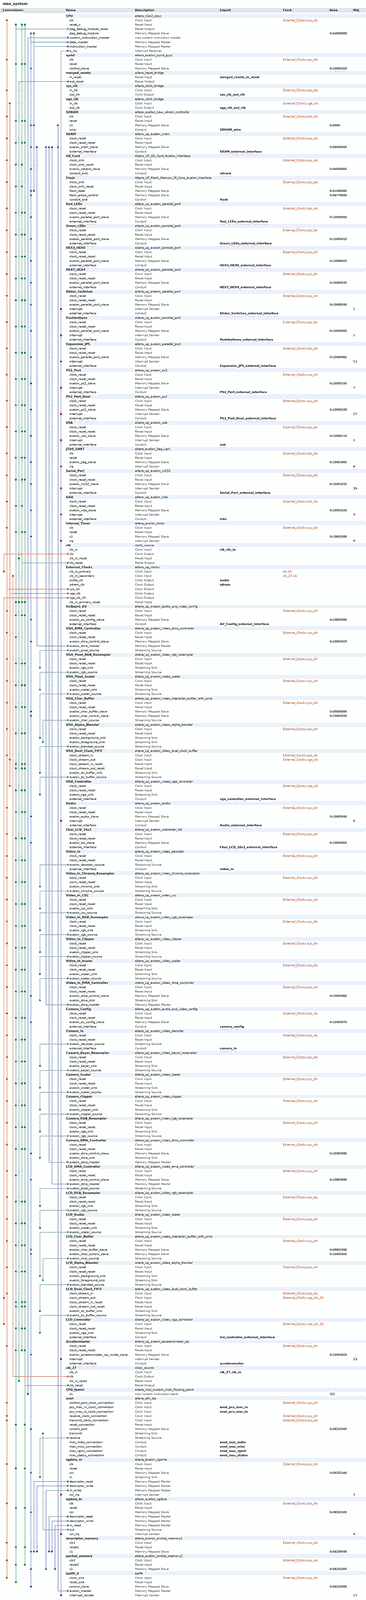
[diagram p0: system contents, whole]
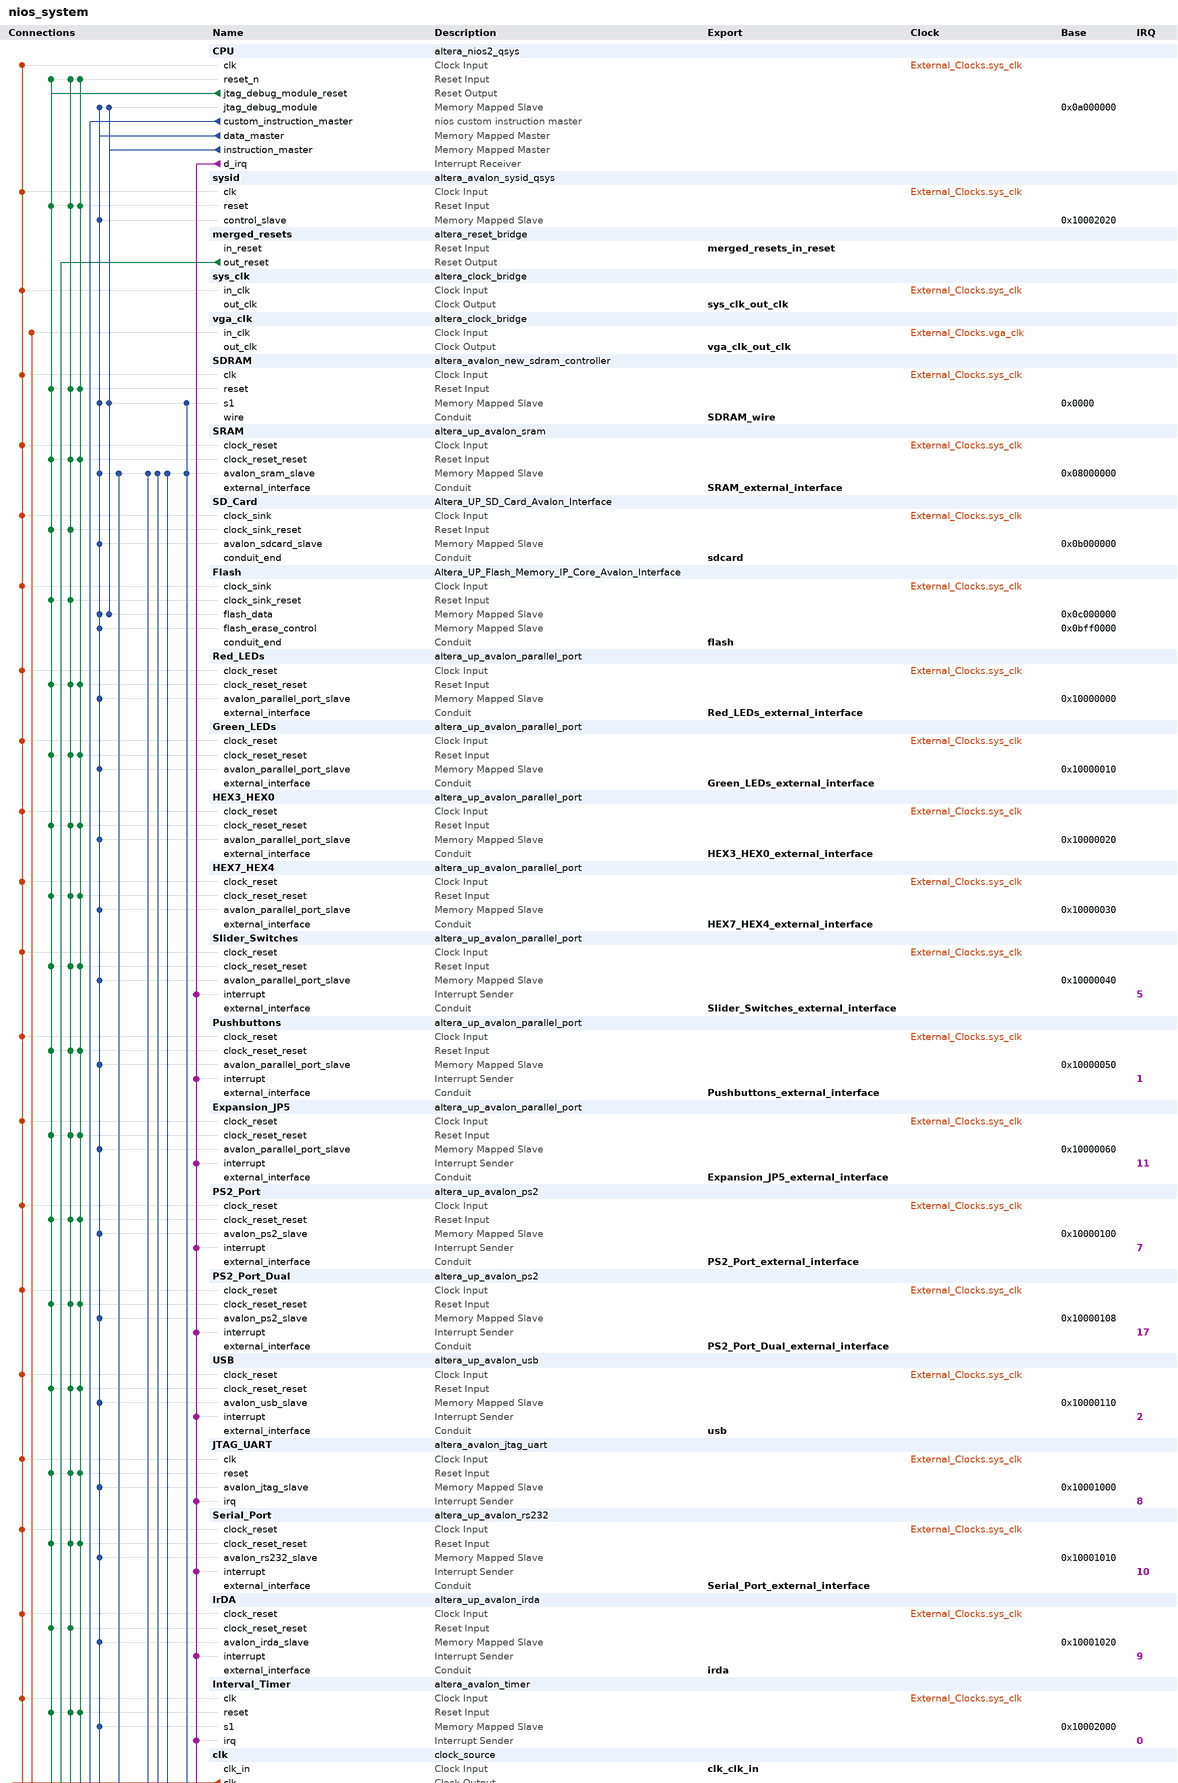
[diagram p1: system contents, upper part]
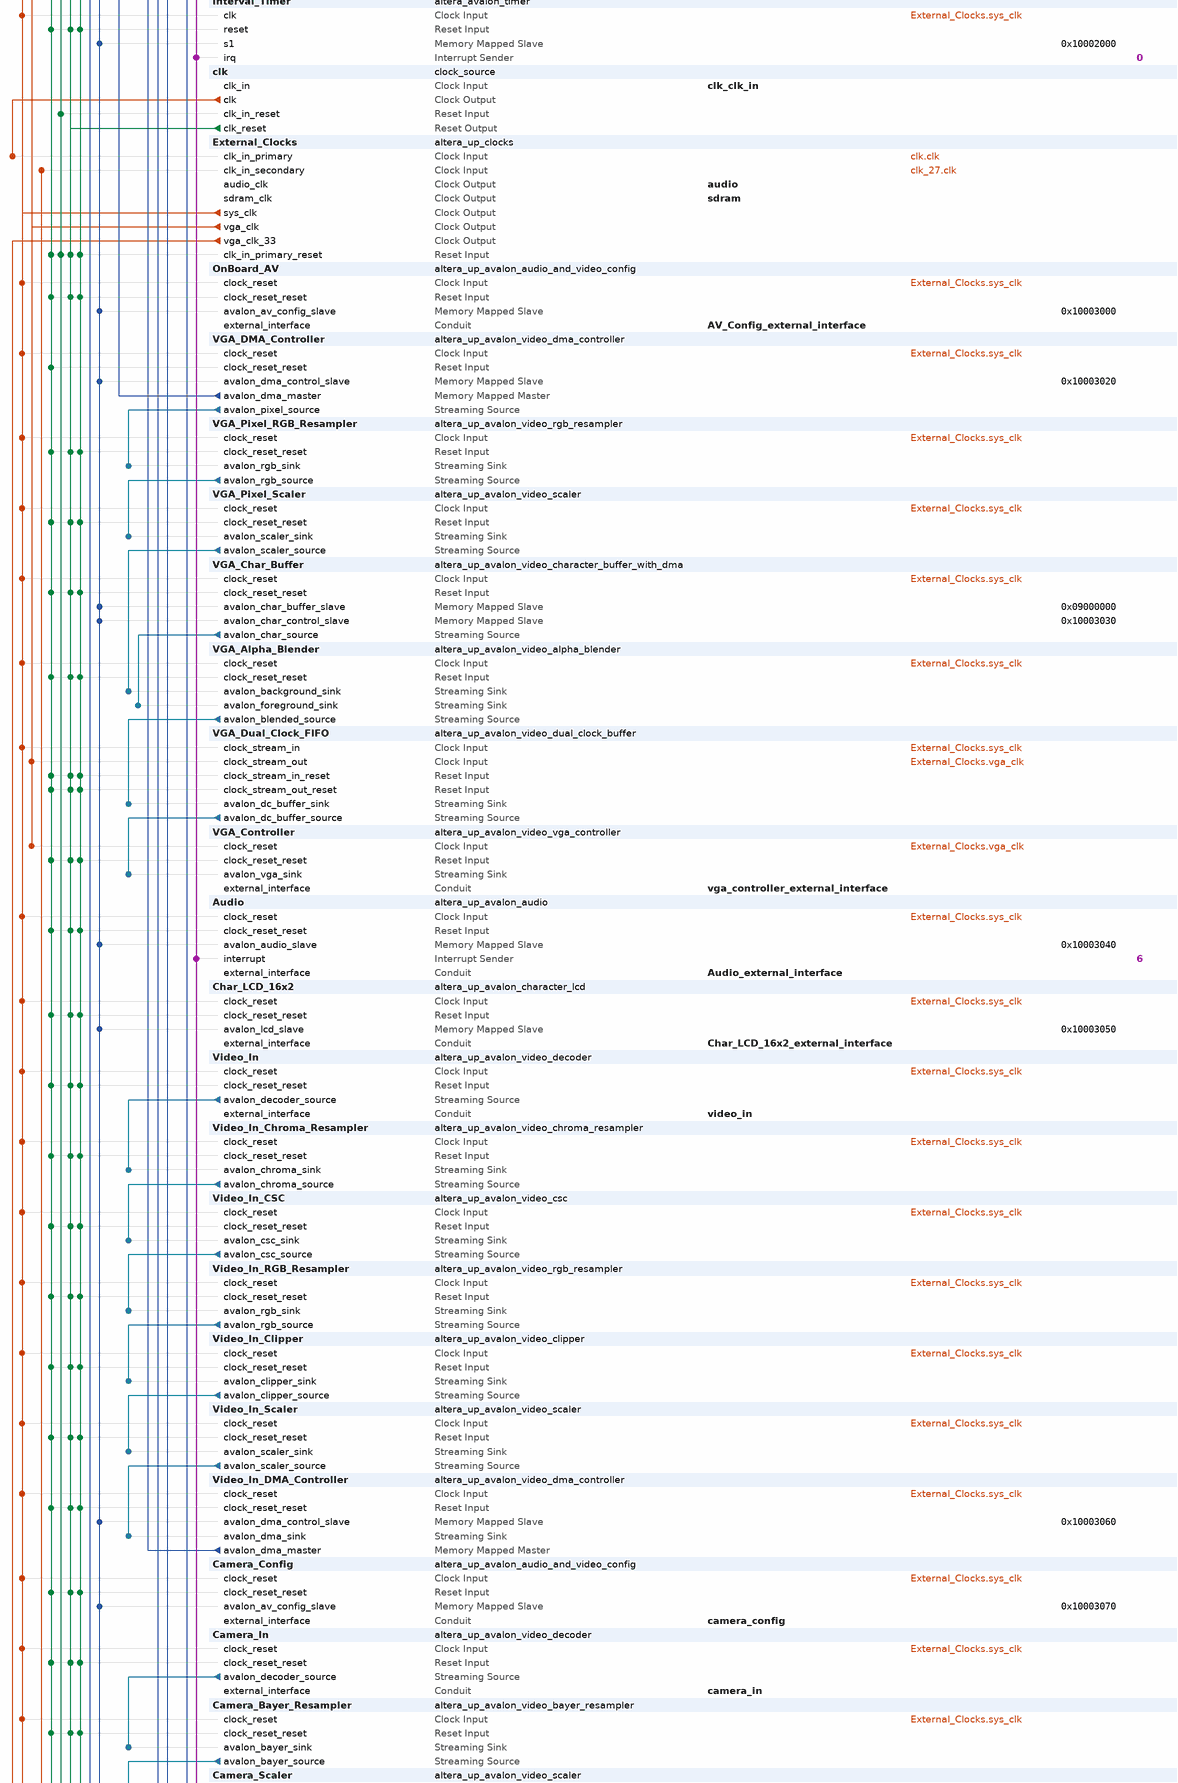
[diagram p2: system contents, middle part]
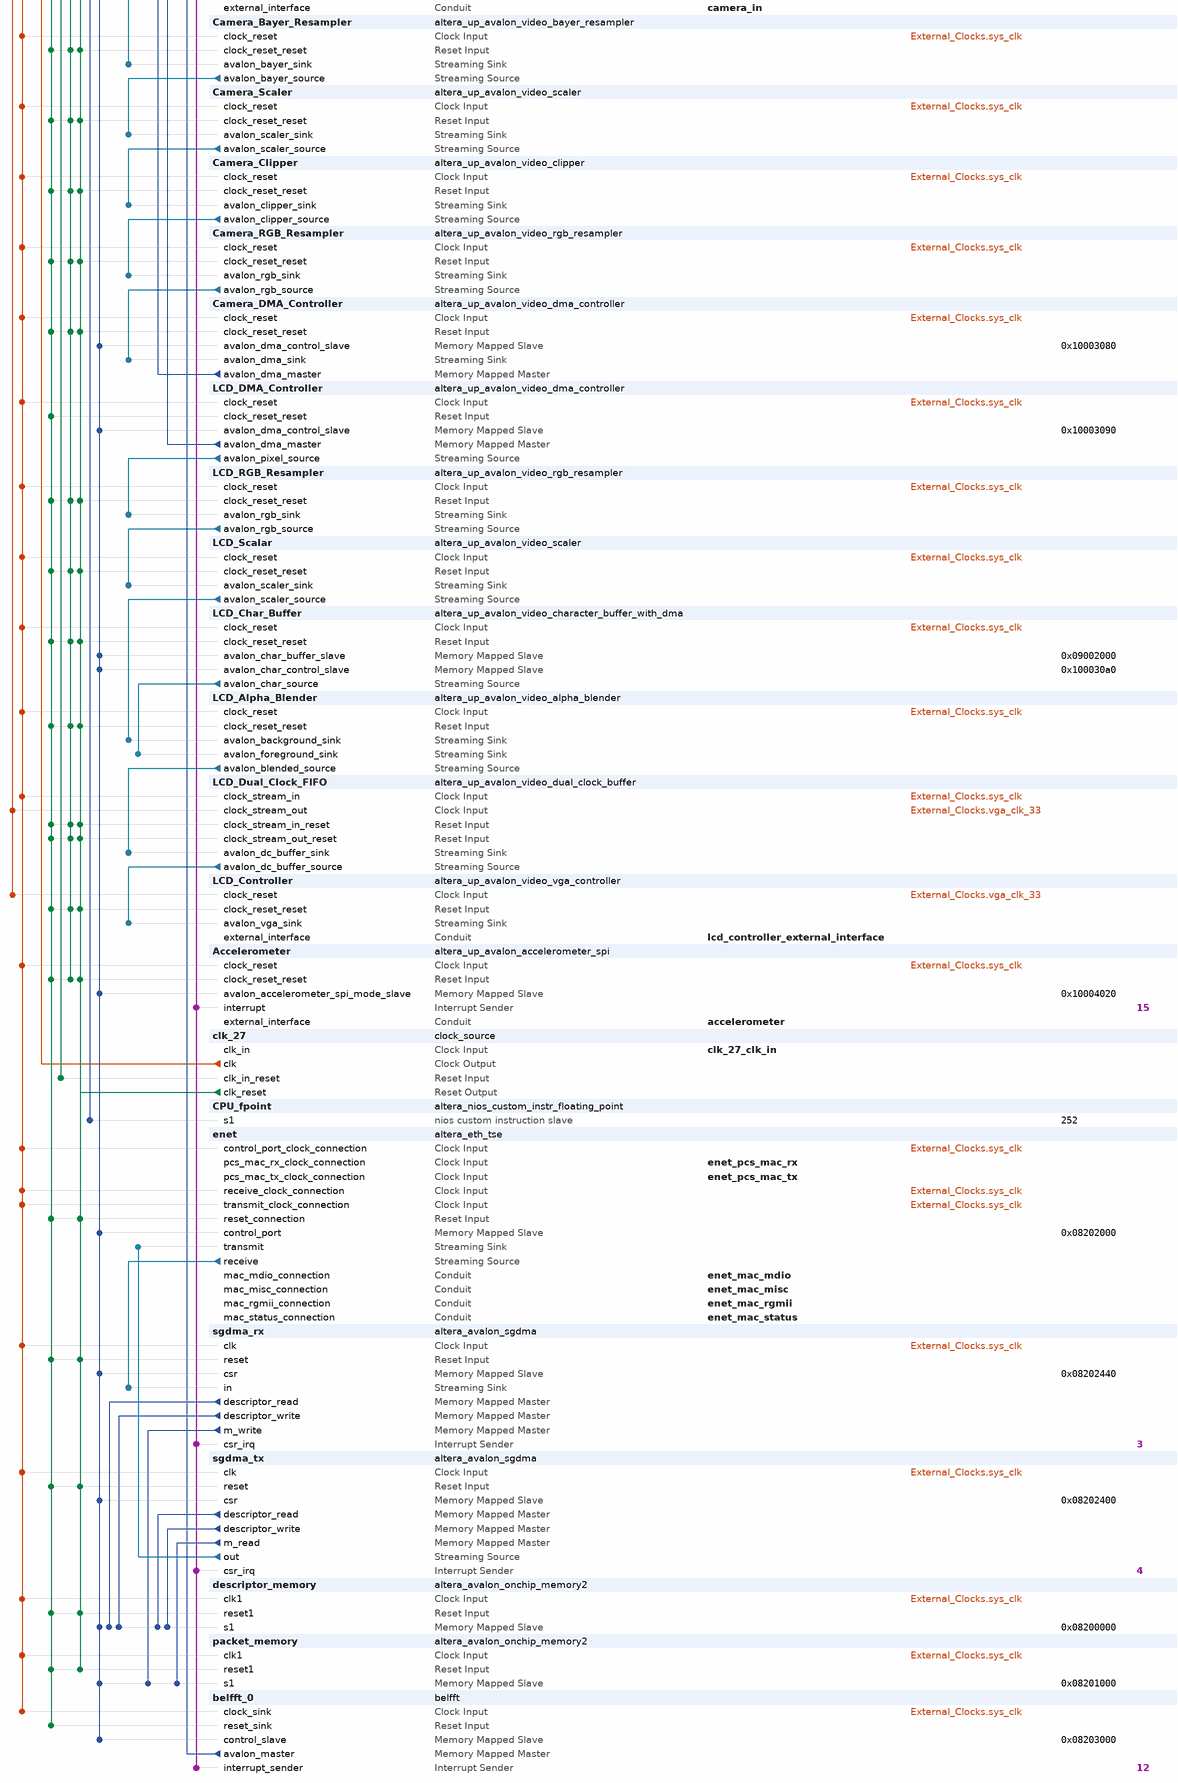
[diagram p3: system contents, lower part]
# Platform Designer (Qsys) system nios_system, Cyclone IV E EP4CE115F29C7
# Parameters at their usual value, and those the tool derives, are not listed.
package require -exact qsys 13.0
create_system nios_system
set_project_property DEVICE_FAMILY {Cyclone IV E}
set_project_property DEVICE EP4CE115F29C7

add_instance CPU altera_nios2_qsys 13.0
set_instance_parameter_value CPU muldiv_divider true
set_instance_parameter_value CPU manuallyAssignCpuID false
set_instance_parameter_value CPU resetSlave SDRAM.s1
set_instance_parameter_value CPU exceptionSlave SDRAM.s1
set_instance_parameter_value CPU breakSlave CPU.jtag_debug_module
set_instance_parameter_value CPU mmu_processIDNumBits 10
set_instance_parameter_value CPU impl Fast
set_instance_parameter_value CPU icache_size 4096
set_instance_parameter_value CPU debug_level Level2
set_instance_parameter_value CPU dcache_size 0
set_instance_parameter_value CPU dcache_lineSize 4

add_instance sysid altera_avalon_sysid_qsys 13.0
set_instance_parameter_value sysid id 0

add_instance merged_resets altera_reset_bridge 13.0
set_instance_parameter_value merged_resets ACTIVE_LOW_RESET 1
set_instance_parameter_value merged_resets SYNCHRONOUS_EDGES none

add_instance sys_clk altera_clock_bridge 13.0
set_instance_parameter_value sys_clk DERIVED_CLOCK_RATE 50000000
set_instance_parameter_value sys_clk EXPLICIT_CLOCK_RATE 0

add_instance vga_clk altera_clock_bridge 13.0
set_instance_parameter_value vga_clk DERIVED_CLOCK_RATE 25000000
set_instance_parameter_value vga_clk EXPLICIT_CLOCK_RATE 0

add_instance SDRAM altera_avalon_new_sdram_controller 13.0.1.99.2
set_instance_parameter_value SDRAM TAC 5.5
set_instance_parameter_value SDRAM TRCD 20.0
set_instance_parameter_value SDRAM TRP 20.0
set_instance_parameter_value SDRAM casLatency 3
set_instance_parameter_value SDRAM columnWidth 10
set_instance_parameter_value SDRAM dataWidth 32
set_instance_parameter_value SDRAM generateSimulationModel false
set_instance_parameter_value SDRAM model custom
set_instance_parameter_value SDRAM numberOfBanks 4
set_instance_parameter_value SDRAM numberOfChipSelects 1
set_instance_parameter_value SDRAM powerUpDelay 100.0
set_instance_parameter_value SDRAM refreshPeriod 15.625
set_instance_parameter_value SDRAM rowWidth 13

add_instance SRAM altera_up_avalon_sram 13.0
set_instance_parameter_value SRAM board DE2-115
set_instance_parameter_value SRAM pixel_buffer true

add_instance SD_Card Altera_UP_SD_Card_Avalon_Interface 13.0

add_instance Flash Altera_UP_Flash_Memory_IP_Core_Avalon_Interface 13.0
set_instance_parameter_value Flash FLASH_MEMORY_ADDRESS_WIDTH 23

add_instance Red_LEDs altera_up_avalon_parallel_port 13.0
set_instance_parameter_value Red_LEDs board DE2-115
set_instance_parameter_value Red_LEDs preset LEDs
set_instance_parameter_value Red_LEDs leds Red
set_instance_parameter_value Red_LEDs capture false
set_instance_parameter_value Red_LEDs edge Rising
set_instance_parameter_value Red_LEDs irq false

add_instance Green_LEDs altera_up_avalon_parallel_port 13.0
set_instance_parameter_value Green_LEDs board DE2-115
set_instance_parameter_value Green_LEDs preset LEDs
set_instance_parameter_value Green_LEDs capture false
set_instance_parameter_value Green_LEDs edge Rising
set_instance_parameter_value Green_LEDs irq false

add_instance HEX3_HEX0 altera_up_avalon_parallel_port 13.0
set_instance_parameter_value HEX3_HEX0 board DE2-115
set_instance_parameter_value HEX3_HEX0 preset {Seven Segment Displays}
set_instance_parameter_value HEX3_HEX0 capture false
set_instance_parameter_value HEX3_HEX0 edge Rising
set_instance_parameter_value HEX3_HEX0 irq false

add_instance HEX7_HEX4 altera_up_avalon_parallel_port 13.0
set_instance_parameter_value HEX7_HEX4 board DE2-115
set_instance_parameter_value HEX7_HEX4 preset {Seven Segment Displays}
set_instance_parameter_value HEX7_HEX4 sevensegs {7 to 4}
set_instance_parameter_value HEX7_HEX4 capture false
set_instance_parameter_value HEX7_HEX4 edge Rising
set_instance_parameter_value HEX7_HEX4 irq false

add_instance Slider_Switches altera_up_avalon_parallel_port 13.0
set_instance_parameter_value Slider_Switches board DE2-115
set_instance_parameter_value Slider_Switches custom_port true
set_instance_parameter_value Slider_Switches preset {Slider Switches}
set_instance_parameter_value Slider_Switches capture true
set_instance_parameter_value Slider_Switches edge Either
set_instance_parameter_value Slider_Switches irq true

add_instance Pushbuttons altera_up_avalon_parallel_port 13.0
set_instance_parameter_value Pushbuttons board DE2-115
set_instance_parameter_value Pushbuttons preset Pushbuttons
set_instance_parameter_value Pushbuttons capture true
set_instance_parameter_value Pushbuttons edge Falling
set_instance_parameter_value Pushbuttons irq true

add_instance Expansion_JP5 altera_up_avalon_parallel_port 13.0
set_instance_parameter_value Expansion_JP5 board DE2-115
set_instance_parameter_value Expansion_JP5 preset {Expansion Header}
set_instance_parameter_value Expansion_JP5 capture true
set_instance_parameter_value Expansion_JP5 edge Falling
set_instance_parameter_value Expansion_JP5 irq true

add_instance PS2_Port altera_up_avalon_ps2 13.0

add_instance PS2_Port_Dual altera_up_avalon_ps2 13.0

add_instance USB altera_up_avalon_usb 13.0

add_instance JTAG_UART altera_avalon_jtag_uart 13.0.1.99.2
set_instance_parameter_value JTAG_UART simInteractiveOptions INTERACTIVE_ASCII_OUTPUT

add_instance Serial_Port altera_up_avalon_rs232 13.0
set_instance_parameter_value Serial_Port baud 115200
set_instance_parameter_value Serial_Port parity Odd

add_instance IrDA altera_up_avalon_irda 13.0
set_instance_parameter_value IrDA clk_rate 50000000
set_instance_parameter_value IrDA baud 115200
set_instance_parameter_value IrDA parity None

add_instance Interval_Timer altera_avalon_timer 13.0.1.99.2
set_instance_parameter_value Interval_Timer period 125.0
set_instance_parameter_value Interval_Timer periodUnits MSEC

add_instance clk clock_source 13.0
set_instance_parameter_value clk clockFrequency 50000000

add_instance External_Clocks altera_up_clocks 13.0
set_instance_parameter_value External_Clocks board VEEK-MT
set_instance_parameter_value External_Clocks vga_clk true
set_instance_parameter_value External_Clocks audio_clk true
set_instance_parameter_value External_Clocks audio_clk_freq 12.288

add_instance OnBoard_AV altera_up_avalon_audio_and_video_config 13.0
set_instance_parameter_value OnBoard_AV board DE2-115
set_instance_parameter_value OnBoard_AV audio_in {Microphone to ADC}
set_instance_parameter_value OnBoard_AV line_in_bypass true
set_instance_parameter_value OnBoard_AV bit_length 32
set_instance_parameter_value OnBoard_AV sampling_rate {32 kHz}

add_instance VGA_DMA_Controller altera_up_avalon_video_dma_controller 13.0
set_instance_parameter_value VGA_DMA_Controller mode {From Memory to Stream}
set_instance_parameter_value VGA_DMA_Controller addr_mode X-Y
set_instance_parameter_value VGA_DMA_Controller start_address 134217728
set_instance_parameter_value VGA_DMA_Controller back_start_address 134217728
set_instance_parameter_value VGA_DMA_Controller width 320
set_instance_parameter_value VGA_DMA_Controller height 240
set_instance_parameter_value VGA_DMA_Controller color_bits 16
set_instance_parameter_value VGA_DMA_Controller color_planes 1
set_instance_parameter_value VGA_DMA_Controller dma_enabled false

add_instance VGA_Pixel_RGB_Resampler altera_up_avalon_video_rgb_resampler 13.0
set_instance_parameter_value VGA_Pixel_RGB_Resampler input_type {16-bit RGB}
set_instance_parameter_value VGA_Pixel_RGB_Resampler output_type {30-bit RGB}
set_instance_parameter_value VGA_Pixel_RGB_Resampler alpha 255

add_instance VGA_Pixel_Scaler altera_up_avalon_video_scaler 13.0
set_instance_parameter_value VGA_Pixel_Scaler width_scaling 2
set_instance_parameter_value VGA_Pixel_Scaler height_scaling 2
set_instance_parameter_value VGA_Pixel_Scaler width_in 320
set_instance_parameter_value VGA_Pixel_Scaler color_bits 10
set_instance_parameter_value VGA_Pixel_Scaler color_planes 3

add_instance VGA_Char_Buffer altera_up_avalon_video_character_buffer_with_dma 13.0
set_instance_parameter_value VGA_Char_Buffer enable_transparency true

add_instance VGA_Alpha_Blender altera_up_avalon_video_alpha_blender 13.0

add_instance VGA_Dual_Clock_FIFO altera_up_avalon_video_dual_clock_buffer 13.0
set_instance_parameter_value VGA_Dual_Clock_FIFO color_bits 10

add_instance VGA_Controller altera_up_avalon_video_vga_controller 13.0
set_instance_parameter_value VGA_Controller board DE2-115

add_instance Audio altera_up_avalon_audio 13.0
set_instance_parameter_value Audio avalon_bus_type {Memory Mapped}
set_instance_parameter_value Audio audio_in true
set_instance_parameter_value Audio dw 32

add_instance Char_LCD_16x2 altera_up_avalon_character_lcd 13.0
set_instance_parameter_value Char_LCD_16x2 cursor Both

add_instance Video_In altera_up_avalon_video_decoder 13.0

add_instance Video_In_Chroma_Resampler altera_up_avalon_video_chroma_resampler 13.0

add_instance Video_In_CSC altera_up_avalon_video_csc 13.0

add_instance Video_In_RGB_Resampler altera_up_avalon_video_rgb_resampler 13.0
set_instance_parameter_value Video_In_RGB_Resampler input_type {24-bit RGB}
set_instance_parameter_value Video_In_RGB_Resampler output_type {16-bit RGB}
set_instance_parameter_value Video_In_RGB_Resampler alpha 1023

add_instance Video_In_Clipper altera_up_avalon_video_clipper 13.0
set_instance_parameter_value Video_In_Clipper color_bits 16
set_instance_parameter_value Video_In_Clipper color_planes 1

add_instance Video_In_Scaler altera_up_avalon_video_scaler 13.0
set_instance_parameter_value Video_In_Scaler width_scaling 0.5
set_instance_parameter_value Video_In_Scaler height_scaling 1
set_instance_parameter_value Video_In_Scaler width_in 640
set_instance_parameter_value Video_In_Scaler color_bits 16
set_instance_parameter_value Video_In_Scaler color_planes 1

add_instance Video_In_DMA_Controller altera_up_avalon_video_dma_controller 13.0
set_instance_parameter_value Video_In_DMA_Controller mode {From Stream to Memory}
set_instance_parameter_value Video_In_DMA_Controller addr_mode X-Y
set_instance_parameter_value Video_In_DMA_Controller start_address 134217728
set_instance_parameter_value Video_In_DMA_Controller back_start_address 134217728
set_instance_parameter_value Video_In_DMA_Controller width 320
set_instance_parameter_value Video_In_DMA_Controller height 240
set_instance_parameter_value Video_In_DMA_Controller color_bits 16
set_instance_parameter_value Video_In_DMA_Controller color_planes 1
set_instance_parameter_value Video_In_DMA_Controller dma_enabled false

add_instance Camera_Config altera_up_avalon_audio_and_video_config 13.0
set_instance_parameter_value Camera_Config board DE2
set_instance_parameter_value Camera_Config audio_in {Microphone to ADC}
set_instance_parameter_value Camera_Config line_in_bypass false
set_instance_parameter_value Camera_Config bit_length 24
set_instance_parameter_value Camera_Config sampling_rate {48 kHz}
set_instance_parameter_value Camera_Config d5m_resolution {1280 x 720}
set_instance_parameter_value Camera_Config exposure true

add_instance Camera_In altera_up_avalon_video_decoder 13.0
set_instance_parameter_value Camera_In video_source {5MP Daughtercard (THDB_D5M)}

add_instance Camera_Bayer_Resampler altera_up_avalon_video_bayer_resampler 13.0
set_instance_parameter_value Camera_Bayer_Resampler use_custom_format false
set_instance_parameter_value Camera_Bayer_Resampler custom_width_in 1280
set_instance_parameter_value Camera_Bayer_Resampler custom_height_in 720

add_instance Camera_Scaler altera_up_avalon_video_scaler 13.0
set_instance_parameter_value Camera_Scaler width_scaling 0.75
set_instance_parameter_value Camera_Scaler height_scaling 0.75
set_instance_parameter_value Camera_Scaler width_in 640
set_instance_parameter_value Camera_Scaler height_in 360
set_instance_parameter_value Camera_Scaler color_bits 8
set_instance_parameter_value Camera_Scaler color_planes 3

add_instance Camera_Clipper altera_up_avalon_video_clipper 13.0
set_instance_parameter_value Camera_Clipper width_in 480
set_instance_parameter_value Camera_Clipper height_in 270
set_instance_parameter_value Camera_Clipper drop_top 15
set_instance_parameter_value Camera_Clipper drop_bottom 15
set_instance_parameter_value Camera_Clipper color_bits 8
set_instance_parameter_value Camera_Clipper color_planes 3

add_instance Camera_RGB_Resampler altera_up_avalon_video_rgb_resampler 13.0
set_instance_parameter_value Camera_RGB_Resampler input_type {24-bit RGB}
set_instance_parameter_value Camera_RGB_Resampler output_type {16-bit RGB}
set_instance_parameter_value Camera_RGB_Resampler alpha 1023

add_instance Camera_DMA_Controller altera_up_avalon_video_dma_controller 13.0
set_instance_parameter_value Camera_DMA_Controller mode {From Stream to Memory}
set_instance_parameter_value Camera_DMA_Controller addr_mode X-Y
set_instance_parameter_value Camera_DMA_Controller start_address 135266304
set_instance_parameter_value Camera_DMA_Controller back_start_address 135266304
set_instance_parameter_value Camera_DMA_Controller width 400
set_instance_parameter_value Camera_DMA_Controller height 240
set_instance_parameter_value Camera_DMA_Controller color_bits 16
set_instance_parameter_value Camera_DMA_Controller color_planes 1
set_instance_parameter_value Camera_DMA_Controller dma_enabled false

add_instance LCD_DMA_Controller altera_up_avalon_video_dma_controller 13.0
set_instance_parameter_value LCD_DMA_Controller mode {From Memory to Stream}
set_instance_parameter_value LCD_DMA_Controller addr_mode X-Y
set_instance_parameter_value LCD_DMA_Controller start_address 135266304
set_instance_parameter_value LCD_DMA_Controller back_start_address 135266304
set_instance_parameter_value LCD_DMA_Controller width 400
set_instance_parameter_value LCD_DMA_Controller height 240
set_instance_parameter_value LCD_DMA_Controller color_bits 16
set_instance_parameter_value LCD_DMA_Controller color_planes 1
set_instance_parameter_value LCD_DMA_Controller dma_enabled false

add_instance LCD_RGB_Resampler altera_up_avalon_video_rgb_resampler 13.0
set_instance_parameter_value LCD_RGB_Resampler input_type {16-bit RGB}
set_instance_parameter_value LCD_RGB_Resampler output_type {30-bit RGB}
set_instance_parameter_value LCD_RGB_Resampler alpha 1023

add_instance LCD_Scalar altera_up_avalon_video_scaler 13.0
set_instance_parameter_value LCD_Scalar width_scaling 2
set_instance_parameter_value LCD_Scalar height_scaling 2
set_instance_parameter_value LCD_Scalar width_in 400
set_instance_parameter_value LCD_Scalar color_bits 10
set_instance_parameter_value LCD_Scalar color_planes 3

add_instance LCD_Char_Buffer altera_up_avalon_video_character_buffer_with_dma 13.0
set_instance_parameter_value LCD_Char_Buffer vga_device {LCD with touchscreen (TRDB_LTM)}
set_instance_parameter_value LCD_Char_Buffer enable_transparency true

add_instance LCD_Alpha_Blender altera_up_avalon_video_alpha_blender 13.0

add_instance LCD_Dual_Clock_FIFO altera_up_avalon_video_dual_clock_buffer 13.0
set_instance_parameter_value LCD_Dual_Clock_FIFO color_bits 10

add_instance LCD_Controller altera_up_avalon_video_vga_controller 13.0
set_instance_parameter_value LCD_Controller board DE2-115

add_instance Accelerometer altera_up_avalon_accelerometer_spi 13.0

add_instance clk_27 clock_source 13.0
set_instance_parameter_value clk_27 clockFrequency 27000000

add_instance CPU_fpoint altera_nios_custom_instr_floating_point 13.0

add_instance enet altera_eth_tse 13.0
set_instance_parameter_value enet core_variation MAC_ONLY
set_instance_parameter_value enet ifGMII RGMII
set_instance_parameter_value enet transceiver_type NONE
set_instance_parameter_value enet enable_hd_logic true
set_instance_parameter_value enet stat_cnt_ena true
set_instance_parameter_value enet enable_shift16 true
set_instance_parameter_value enet enable_mac_flow_ctrl false
set_instance_parameter_value enet enable_magic_detect false
set_instance_parameter_value enet mdio_clk_div 20
set_instance_parameter_value enet ing_addr 11

add_instance sgdma_rx altera_avalon_sgdma 13.0.1.99.2
set_instance_parameter_value sgdma_rx enableBurstTransfers false
set_instance_parameter_value sgdma_rx enableUnalignedTransfers false
set_instance_parameter_value sgdma_rx readBlockDataWidth 32
set_instance_parameter_value sgdma_rx sinkErrorWidth 6
set_instance_parameter_value sgdma_rx sourceErrorWidth 0
set_instance_parameter_value sgdma_rx transferMode STREAM_TO_MEMORY
set_instance_parameter_value sgdma_rx writeBurstcountWidth 4

add_instance sgdma_tx altera_avalon_sgdma 13.0.1.99.2
set_instance_parameter_value sgdma_tx enableBurstTransfers false
set_instance_parameter_value sgdma_tx enableUnalignedTransfers false
set_instance_parameter_value sgdma_tx readBlockDataWidth 32
set_instance_parameter_value sgdma_tx sinkErrorWidth 0
set_instance_parameter_value sgdma_tx sourceErrorWidth 1
set_instance_parameter_value sgdma_tx transferMode MEMORY_TO_STREAM
set_instance_parameter_value sgdma_tx writeBurstcountWidth 4

add_instance descriptor_memory altera_avalon_onchip_memory2 13.0.1.99.2
set_instance_parameter_value descriptor_memory dataWidth 32
set_instance_parameter_value descriptor_memory dualPort false
set_instance_parameter_value descriptor_memory initMemContent true
set_instance_parameter_value descriptor_memory initializationFileName onchip_mem.hex
set_instance_parameter_value descriptor_memory memorySize 4096

add_instance packet_memory altera_avalon_onchip_memory2 13.0.1.99.2
set_instance_parameter_value packet_memory dataWidth 32
set_instance_parameter_value packet_memory dualPort false
set_instance_parameter_value packet_memory initMemContent true
set_instance_parameter_value packet_memory initializationFileName onchip_mem.hex
set_instance_parameter_value packet_memory memorySize 4096

add_instance belfft_0 belfft 1.0

# connections
add_connection clk.clk External_Clocks.clk_in_primary clock
add_connection clk_27.clk External_Clocks.clk_in_secondary clock
add_connection External_Clocks.sys_clk Accelerometer.clock_reset clock
add_connection External_Clocks.sys_clk Audio.clock_reset clock
add_connection External_Clocks.sys_clk belfft_0.clock_sink clock
add_connection External_Clocks.sys_clk Camera_Bayer_Resampler.clock_reset clock
add_connection External_Clocks.sys_clk Camera_Clipper.clock_reset clock
add_connection External_Clocks.sys_clk Camera_Config.clock_reset clock
add_connection External_Clocks.sys_clk Camera_DMA_Controller.clock_reset clock
add_connection External_Clocks.sys_clk Camera_In.clock_reset clock
add_connection External_Clocks.sys_clk Camera_RGB_Resampler.clock_reset clock
add_connection External_Clocks.sys_clk Camera_Scaler.clock_reset clock
add_connection External_Clocks.sys_clk Char_LCD_16x2.clock_reset clock
add_connection External_Clocks.sys_clk CPU.clk clock
add_connection External_Clocks.sys_clk descriptor_memory.clk1 clock
add_connection External_Clocks.sys_clk enet.control_port_clock_connection clock
add_connection External_Clocks.sys_clk enet.receive_clock_connection clock
add_connection External_Clocks.sys_clk enet.transmit_clock_connection clock
add_connection External_Clocks.sys_clk Expansion_JP5.clock_reset clock
add_connection External_Clocks.sys_clk Flash.clock_sink clock
add_connection External_Clocks.sys_clk Green_LEDs.clock_reset clock
add_connection External_Clocks.sys_clk HEX3_HEX0.clock_reset clock
add_connection External_Clocks.sys_clk HEX7_HEX4.clock_reset clock
add_connection External_Clocks.sys_clk Interval_Timer.clk clock
add_connection External_Clocks.sys_clk IrDA.clock_reset clock
add_connection External_Clocks.sys_clk JTAG_UART.clk clock
add_connection External_Clocks.sys_clk LCD_Alpha_Blender.clock_reset clock
add_connection External_Clocks.sys_clk LCD_Char_Buffer.clock_reset clock
add_connection External_Clocks.sys_clk LCD_DMA_Controller.clock_reset clock
add_connection External_Clocks.sys_clk LCD_Dual_Clock_FIFO.clock_stream_in clock
add_connection External_Clocks.sys_clk LCD_RGB_Resampler.clock_reset clock
add_connection External_Clocks.sys_clk LCD_Scalar.clock_reset clock
add_connection External_Clocks.sys_clk OnBoard_AV.clock_reset clock
add_connection External_Clocks.sys_clk packet_memory.clk1 clock
add_connection External_Clocks.sys_clk PS2_Port.clock_reset clock
add_connection External_Clocks.sys_clk PS2_Port_Dual.clock_reset clock
add_connection External_Clocks.sys_clk Pushbuttons.clock_reset clock
add_connection External_Clocks.sys_clk Red_LEDs.clock_reset clock
add_connection External_Clocks.sys_clk SD_Card.clock_sink clock
add_connection External_Clocks.sys_clk SDRAM.clk clock
add_connection External_Clocks.sys_clk Serial_Port.clock_reset clock
add_connection External_Clocks.sys_clk sgdma_rx.clk clock
add_connection External_Clocks.sys_clk sgdma_tx.clk clock
add_connection External_Clocks.sys_clk Slider_Switches.clock_reset clock
add_connection External_Clocks.sys_clk SRAM.clock_reset clock
add_connection External_Clocks.sys_clk sys_clk.in_clk clock
add_connection External_Clocks.sys_clk sysid.clk clock
add_connection External_Clocks.sys_clk USB.clock_reset clock
add_connection External_Clocks.sys_clk VGA_Alpha_Blender.clock_reset clock
add_connection External_Clocks.sys_clk VGA_Char_Buffer.clock_reset clock
add_connection External_Clocks.sys_clk VGA_DMA_Controller.clock_reset clock
add_connection External_Clocks.sys_clk VGA_Dual_Clock_FIFO.clock_stream_in clock
add_connection External_Clocks.sys_clk VGA_Pixel_RGB_Resampler.clock_reset clock
add_connection External_Clocks.sys_clk VGA_Pixel_Scaler.clock_reset clock
add_connection External_Clocks.sys_clk Video_In.clock_reset clock
add_connection External_Clocks.sys_clk Video_In_Chroma_Resampler.clock_reset clock
add_connection External_Clocks.sys_clk Video_In_Clipper.clock_reset clock
add_connection External_Clocks.sys_clk Video_In_CSC.clock_reset clock
add_connection External_Clocks.sys_clk Video_In_DMA_Controller.clock_reset clock
add_connection External_Clocks.sys_clk Video_In_RGB_Resampler.clock_reset clock
add_connection External_Clocks.sys_clk Video_In_Scaler.clock_reset clock
add_connection External_Clocks.vga_clk vga_clk.in_clk clock
add_connection External_Clocks.vga_clk VGA_Controller.clock_reset clock
add_connection External_Clocks.vga_clk VGA_Dual_Clock_FIFO.clock_stream_out clock
add_connection External_Clocks.vga_clk_33 LCD_Controller.clock_reset clock
add_connection External_Clocks.vga_clk_33 LCD_Dual_Clock_FIFO.clock_stream_out clock
add_connection clk.clk_reset Accelerometer.clock_reset_reset reset
add_connection clk.clk_reset Audio.clock_reset_reset reset
add_connection clk.clk_reset Camera_Bayer_Resampler.clock_reset_reset reset
add_connection clk.clk_reset Camera_Clipper.clock_reset_reset reset
add_connection clk.clk_reset Camera_Config.clock_reset_reset reset
add_connection clk.clk_reset Camera_DMA_Controller.clock_reset_reset reset
add_connection clk.clk_reset Camera_In.clock_reset_reset reset
add_connection clk.clk_reset Camera_RGB_Resampler.clock_reset_reset reset
add_connection clk.clk_reset Camera_Scaler.clock_reset_reset reset
add_connection clk.clk_reset Char_LCD_16x2.clock_reset_reset reset
add_connection clk.clk_reset CPU.reset_n reset
add_connection clk.clk_reset Expansion_JP5.clock_reset_reset reset
add_connection clk.clk_reset External_Clocks.clk_in_primary_reset reset
add_connection clk.clk_reset Flash.clock_sink_reset reset
add_connection clk.clk_reset Green_LEDs.clock_reset_reset reset
add_connection clk.clk_reset HEX3_HEX0.clock_reset_reset reset
add_connection clk.clk_reset HEX7_HEX4.clock_reset_reset reset
add_connection clk.clk_reset Interval_Timer.reset reset
add_connection clk.clk_reset IrDA.clock_reset_reset reset
add_connection clk.clk_reset JTAG_UART.reset reset
add_connection clk.clk_reset LCD_Alpha_Blender.clock_reset_reset reset
add_connection clk.clk_reset LCD_Char_Buffer.clock_reset_reset reset
add_connection clk.clk_reset LCD_Controller.clock_reset_reset reset
add_connection clk.clk_reset LCD_Dual_Clock_FIFO.clock_stream_in_reset reset
add_connection clk.clk_reset LCD_Dual_Clock_FIFO.clock_stream_out_reset reset
add_connection clk.clk_reset LCD_RGB_Resampler.clock_reset_reset reset
add_connection clk.clk_reset LCD_Scalar.clock_reset_reset reset
add_connection clk.clk_reset OnBoard_AV.clock_reset_reset reset
add_connection clk.clk_reset PS2_Port.clock_reset_reset reset
add_connection clk.clk_reset PS2_Port_Dual.clock_reset_reset reset
add_connection clk.clk_reset Pushbuttons.clock_reset_reset reset
add_connection clk.clk_reset Red_LEDs.clock_reset_reset reset
add_connection clk.clk_reset SD_Card.clock_sink_reset reset
add_connection clk.clk_reset SDRAM.reset reset
add_connection clk.clk_reset Serial_Port.clock_reset_reset reset
add_connection clk.clk_reset Slider_Switches.clock_reset_reset reset
add_connection clk.clk_reset SRAM.clock_reset_reset reset
add_connection clk.clk_reset sysid.reset reset
add_connection clk.clk_reset USB.clock_reset_reset reset
add_connection clk.clk_reset VGA_Alpha_Blender.clock_reset_reset reset
add_connection clk.clk_reset VGA_Char_Buffer.clock_reset_reset reset
add_connection clk.clk_reset VGA_Controller.clock_reset_reset reset
add_connection clk.clk_reset VGA_Dual_Clock_FIFO.clock_stream_in_reset reset
add_connection clk.clk_reset VGA_Dual_Clock_FIFO.clock_stream_out_reset reset
add_connection clk.clk_reset VGA_Pixel_RGB_Resampler.clock_reset_reset reset
add_connection clk.clk_reset VGA_Pixel_Scaler.clock_reset_reset reset
add_connection clk.clk_reset Video_In.clock_reset_reset reset
add_connection clk.clk_reset Video_In_Chroma_Resampler.clock_reset_reset reset
add_connection clk.clk_reset Video_In_Clipper.clock_reset_reset reset
add_connection clk.clk_reset Video_In_CSC.clock_reset_reset reset
add_connection clk.clk_reset Video_In_DMA_Controller.clock_reset_reset reset
add_connection clk.clk_reset Video_In_RGB_Resampler.clock_reset_reset reset
add_connection clk.clk_reset Video_In_Scaler.clock_reset_reset reset
add_connection clk_27.clk_reset Accelerometer.clock_reset_reset reset
add_connection clk_27.clk_reset Audio.clock_reset_reset reset
add_connection clk_27.clk_reset Camera_Bayer_Resampler.clock_reset_reset reset
add_connection clk_27.clk_reset Camera_Clipper.clock_reset_reset reset
add_connection clk_27.clk_reset Camera_Config.clock_reset_reset reset
add_connection clk_27.clk_reset Camera_DMA_Controller.clock_reset_reset reset
add_connection clk_27.clk_reset Camera_In.clock_reset_reset reset
add_connection clk_27.clk_reset Camera_RGB_Resampler.clock_reset_reset reset
add_connection clk_27.clk_reset Camera_Scaler.clock_reset_reset reset
add_connection clk_27.clk_reset Char_LCD_16x2.clock_reset_reset reset
add_connection clk_27.clk_reset CPU.reset_n reset
add_connection clk_27.clk_reset descriptor_memory.reset1 reset
add_connection clk_27.clk_reset enet.reset_connection reset
add_connection clk_27.clk_reset Expansion_JP5.clock_reset_reset reset
add_connection clk_27.clk_reset External_Clocks.clk_in_primary_reset reset
add_connection clk_27.clk_reset Green_LEDs.clock_reset_reset reset
add_connection clk_27.clk_reset HEX3_HEX0.clock_reset_reset reset
add_connection clk_27.clk_reset HEX7_HEX4.clock_reset_reset reset
add_connection clk_27.clk_reset Interval_Timer.reset reset
add_connection clk_27.clk_reset JTAG_UART.reset reset
add_connection clk_27.clk_reset LCD_Alpha_Blender.clock_reset_reset reset
add_connection clk_27.clk_reset LCD_Char_Buffer.clock_reset_reset reset
add_connection clk_27.clk_reset LCD_Controller.clock_reset_reset reset
add_connection clk_27.clk_reset LCD_Dual_Clock_FIFO.clock_stream_in_reset reset
add_connection clk_27.clk_reset LCD_Dual_Clock_FIFO.clock_stream_out_reset reset
add_connection clk_27.clk_reset LCD_RGB_Resampler.clock_reset_reset reset
add_connection clk_27.clk_reset LCD_Scalar.clock_reset_reset reset
add_connection clk_27.clk_reset OnBoard_AV.clock_reset_reset reset
add_connection clk_27.clk_reset packet_memory.reset1 reset
add_connection clk_27.clk_reset PS2_Port.clock_reset_reset reset
add_connection clk_27.clk_reset PS2_Port_Dual.clock_reset_reset reset
add_connection clk_27.clk_reset Pushbuttons.clock_reset_reset reset
add_connection clk_27.clk_reset Red_LEDs.clock_reset_reset reset
add_connection clk_27.clk_reset SDRAM.reset reset
add_connection clk_27.clk_reset Serial_Port.clock_reset_reset reset
add_connection clk_27.clk_reset sgdma_rx.reset reset
add_connection clk_27.clk_reset sgdma_tx.reset reset
add_connection clk_27.clk_reset Slider_Switches.clock_reset_reset reset
add_connection clk_27.clk_reset SRAM.clock_reset_reset reset
add_connection clk_27.clk_reset sysid.reset reset
add_connection clk_27.clk_reset USB.clock_reset_reset reset
add_connection clk_27.clk_reset VGA_Alpha_Blender.clock_reset_reset reset
add_connection clk_27.clk_reset VGA_Char_Buffer.clock_reset_reset reset
add_connection clk_27.clk_reset VGA_Controller.clock_reset_reset reset
add_connection clk_27.clk_reset VGA_Dual_Clock_FIFO.clock_stream_in_reset reset
add_connection clk_27.clk_reset VGA_Dual_Clock_FIFO.clock_stream_out_reset reset
add_connection clk_27.clk_reset VGA_Pixel_RGB_Resampler.clock_reset_reset reset
add_connection clk_27.clk_reset VGA_Pixel_Scaler.clock_reset_reset reset
add_connection clk_27.clk_reset Video_In.clock_reset_reset reset
add_connection clk_27.clk_reset Video_In_Chroma_Resampler.clock_reset_reset reset
add_connection clk_27.clk_reset Video_In_Clipper.clock_reset_reset reset
add_connection clk_27.clk_reset Video_In_CSC.clock_reset_reset reset
add_connection clk_27.clk_reset Video_In_DMA_Controller.clock_reset_reset reset
add_connection clk_27.clk_reset Video_In_RGB_Resampler.clock_reset_reset reset
add_connection clk_27.clk_reset Video_In_Scaler.clock_reset_reset reset
add_connection CPU.jtag_debug_module_reset Accelerometer.clock_reset_reset reset
add_connection CPU.jtag_debug_module_reset Audio.clock_reset_reset reset
add_connection CPU.jtag_debug_module_reset belfft_0.reset_sink reset
add_connection CPU.jtag_debug_module_reset Camera_Bayer_Resampler.clock_reset_reset reset
add_connection CPU.jtag_debug_module_reset Camera_Clipper.clock_reset_reset reset
add_connection CPU.jtag_debug_module_reset Camera_Config.clock_reset_reset reset
add_connection CPU.jtag_debug_module_reset Camera_DMA_Controller.clock_reset_reset reset
add_connection CPU.jtag_debug_module_reset Camera_In.clock_reset_reset reset
add_connection CPU.jtag_debug_module_reset Camera_RGB_Resampler.clock_reset_reset reset
add_connection CPU.jtag_debug_module_reset Camera_Scaler.clock_reset_reset reset
add_connection CPU.jtag_debug_module_reset Char_LCD_16x2.clock_reset_reset reset
add_connection CPU.jtag_debug_module_reset CPU.reset_n reset
add_connection CPU.jtag_debug_module_reset descriptor_memory.reset1 reset
add_connection CPU.jtag_debug_module_reset enet.reset_connection reset
add_connection CPU.jtag_debug_module_reset Expansion_JP5.clock_reset_reset reset
add_connection CPU.jtag_debug_module_reset External_Clocks.clk_in_primary_reset reset
add_connection CPU.jtag_debug_module_reset Flash.clock_sink_reset reset
add_connection CPU.jtag_debug_module_reset Green_LEDs.clock_reset_reset reset
add_connection CPU.jtag_debug_module_reset HEX3_HEX0.clock_reset_reset reset
add_connection CPU.jtag_debug_module_reset HEX7_HEX4.clock_reset_reset reset
add_connection CPU.jtag_debug_module_reset Interval_Timer.reset reset
add_connection CPU.jtag_debug_module_reset IrDA.clock_reset_reset reset
add_connection CPU.jtag_debug_module_reset JTAG_UART.reset reset
add_connection CPU.jtag_debug_module_reset LCD_Alpha_Blender.clock_reset_reset reset
add_connection CPU.jtag_debug_module_reset LCD_Char_Buffer.clock_reset_reset reset
add_connection CPU.jtag_debug_module_reset LCD_Controller.clock_reset_reset reset
add_connection CPU.jtag_debug_module_reset LCD_DMA_Controller.clock_reset_reset reset
add_connection CPU.jtag_debug_module_reset LCD_Dual_Clock_FIFO.clock_stream_in_reset reset
add_connection CPU.jtag_debug_module_reset LCD_Dual_Clock_FIFO.clock_stream_out_reset reset
add_connection CPU.jtag_debug_module_reset LCD_RGB_Resampler.clock_reset_reset reset
add_connection CPU.jtag_debug_module_reset LCD_Scalar.clock_reset_reset reset
add_connection CPU.jtag_debug_module_reset OnBoard_AV.clock_reset_reset reset
add_connection CPU.jtag_debug_module_reset packet_memory.reset1 reset
add_connection CPU.jtag_debug_module_reset PS2_Port.clock_reset_reset reset
add_connection CPU.jtag_debug_module_reset PS2_Port_Dual.clock_reset_reset reset
add_connection CPU.jtag_debug_module_reset Pushbuttons.clock_reset_reset reset
add_connection CPU.jtag_debug_module_reset Red_LEDs.clock_reset_reset reset
add_connection CPU.jtag_debug_module_reset SD_Card.clock_sink_reset reset
add_connection CPU.jtag_debug_module_reset SDRAM.reset reset
add_connection CPU.jtag_debug_module_reset Serial_Port.clock_reset_reset reset
add_connection CPU.jtag_debug_module_reset sgdma_rx.reset reset
add_connection CPU.jtag_debug_module_reset sgdma_tx.reset reset
add_connection CPU.jtag_debug_module_reset Slider_Switches.clock_reset_reset reset
add_connection CPU.jtag_debug_module_reset SRAM.clock_reset_reset reset
add_connection CPU.jtag_debug_module_reset sysid.reset reset
add_connection CPU.jtag_debug_module_reset USB.clock_reset_reset reset
add_connection CPU.jtag_debug_module_reset VGA_Alpha_Blender.clock_reset_reset reset
add_connection CPU.jtag_debug_module_reset VGA_Char_Buffer.clock_reset_reset reset
add_connection CPU.jtag_debug_module_reset VGA_Controller.clock_reset_reset reset
add_connection CPU.jtag_debug_module_reset VGA_DMA_Controller.clock_reset_reset reset
add_connection CPU.jtag_debug_module_reset VGA_Dual_Clock_FIFO.clock_stream_in_reset reset
add_connection CPU.jtag_debug_module_reset VGA_Dual_Clock_FIFO.clock_stream_out_reset reset
add_connection CPU.jtag_debug_module_reset VGA_Pixel_RGB_Resampler.clock_reset_reset reset
add_connection CPU.jtag_debug_module_reset VGA_Pixel_Scaler.clock_reset_reset reset
add_connection CPU.jtag_debug_module_reset Video_In.clock_reset_reset reset
add_connection CPU.jtag_debug_module_reset Video_In_Chroma_Resampler.clock_reset_reset reset
add_connection CPU.jtag_debug_module_reset Video_In_Clipper.clock_reset_reset reset
add_connection CPU.jtag_debug_module_reset Video_In_CSC.clock_reset_reset reset
add_connection CPU.jtag_debug_module_reset Video_In_DMA_Controller.clock_reset_reset reset
add_connection CPU.jtag_debug_module_reset Video_In_RGB_Resampler.clock_reset_reset reset
add_connection CPU.jtag_debug_module_reset Video_In_Scaler.clock_reset_reset reset
add_connection merged_resets.out_reset clk.clk_in_reset reset
add_connection merged_resets.out_reset clk_27.clk_in_reset reset
add_connection merged_resets.out_reset External_Clocks.clk_in_primary_reset reset
add_connection belfft_0.avalon_master SDRAM.s1 avalon
set_connection_parameter_value belfft_0.avalon_master/SDRAM.s1 baseAddress 0x0000
add_connection belfft_0.avalon_master SRAM.avalon_sram_slave avalon
set_connection_parameter_value belfft_0.avalon_master/SRAM.avalon_sram_slave baseAddress 0x08000000
add_connection Camera_DMA_Controller.avalon_dma_master SRAM.avalon_sram_slave avalon
set_connection_parameter_value Camera_DMA_Controller.avalon_dma_master/SRAM.avalon_sram_slave baseAddress 0x08000000
add_connection CPU.data_master Accelerometer.avalon_accelerometer_spi_mode_slave avalon
set_connection_parameter_value CPU.data_master/Accelerometer.avalon_accelerometer_spi_mode_slave baseAddress 0x10004020
add_connection CPU.data_master Audio.avalon_audio_slave avalon
set_connection_parameter_value CPU.data_master/Audio.avalon_audio_slave baseAddress 0x10003040
add_connection CPU.data_master belfft_0.control_slave avalon
set_connection_parameter_value CPU.data_master/belfft_0.control_slave baseAddress 0x08203000
add_connection CPU.data_master Camera_Config.avalon_av_config_slave avalon
set_connection_parameter_value CPU.data_master/Camera_Config.avalon_av_config_slave baseAddress 0x10003070
add_connection CPU.data_master Camera_DMA_Controller.avalon_dma_control_slave avalon
set_connection_parameter_value CPU.data_master/Camera_DMA_Controller.avalon_dma_control_slave baseAddress 0x10003080
add_connection CPU.data_master Char_LCD_16x2.avalon_lcd_slave avalon
set_connection_parameter_value CPU.data_master/Char_LCD_16x2.avalon_lcd_slave baseAddress 0x10003050
add_connection CPU.data_master CPU.jtag_debug_module avalon
set_connection_parameter_value CPU.data_master/CPU.jtag_debug_module baseAddress 0x0a000000
add_connection CPU.data_master descriptor_memory.s1 avalon
set_connection_parameter_value CPU.data_master/descriptor_memory.s1 baseAddress 0x08200000
add_connection CPU.data_master enet.control_port avalon
set_connection_parameter_value CPU.data_master/enet.control_port baseAddress 0x08202000
add_connection CPU.data_master Expansion_JP5.avalon_parallel_port_slave avalon
set_connection_parameter_value CPU.data_master/Expansion_JP5.avalon_parallel_port_slave baseAddress 0x10000060
add_connection CPU.data_master Flash.flash_data avalon
set_connection_parameter_value CPU.data_master/Flash.flash_data baseAddress 0x0c000000
add_connection CPU.data_master Flash.flash_erase_control avalon
set_connection_parameter_value CPU.data_master/Flash.flash_erase_control baseAddress 0x0bff0000
add_connection CPU.data_master Green_LEDs.avalon_parallel_port_slave avalon
set_connection_parameter_value CPU.data_master/Green_LEDs.avalon_parallel_port_slave baseAddress 0x10000010
add_connection CPU.data_master HEX3_HEX0.avalon_parallel_port_slave avalon
set_connection_parameter_value CPU.data_master/HEX3_HEX0.avalon_parallel_port_slave baseAddress 0x10000020
add_connection CPU.data_master HEX7_HEX4.avalon_parallel_port_slave avalon
set_connection_parameter_value CPU.data_master/HEX7_HEX4.avalon_parallel_port_slave baseAddress 0x10000030
add_connection CPU.data_master Interval_Timer.s1 avalon
set_connection_parameter_value CPU.data_master/Interval_Timer.s1 baseAddress 0x10002000
add_connection CPU.data_master IrDA.avalon_irda_slave avalon
set_connection_parameter_value CPU.data_master/IrDA.avalon_irda_slave baseAddress 0x10001020
add_connection CPU.data_master JTAG_UART.avalon_jtag_slave avalon
set_connection_parameter_value CPU.data_master/JTAG_UART.avalon_jtag_slave baseAddress 0x10001000
add_connection CPU.data_master LCD_Char_Buffer.avalon_char_buffer_slave avalon
set_connection_parameter_value CPU.data_master/LCD_Char_Buffer.avalon_char_buffer_slave baseAddress 0x09002000
add_connection CPU.data_master LCD_Char_Buffer.avalon_char_control_slave avalon
set_connection_parameter_value CPU.data_master/LCD_Char_Buffer.avalon_char_control_slave baseAddress 0x100030a0
add_connection CPU.data_master LCD_DMA_Controller.avalon_dma_control_slave avalon
set_connection_parameter_value CPU.data_master/LCD_DMA_Controller.avalon_dma_control_slave baseAddress 0x10003090
add_connection CPU.data_master OnBoard_AV.avalon_av_config_slave avalon
set_connection_parameter_value CPU.data_master/OnBoard_AV.avalon_av_config_slave baseAddress 0x10003000
add_connection CPU.data_master packet_memory.s1 avalon
set_connection_parameter_value CPU.data_master/packet_memory.s1 baseAddress 0x08201000
add_connection CPU.data_master PS2_Port.avalon_ps2_slave avalon
set_connection_parameter_value CPU.data_master/PS2_Port.avalon_ps2_slave baseAddress 0x10000100
add_connection CPU.data_master PS2_Port_Dual.avalon_ps2_slave avalon
set_connection_parameter_value CPU.data_master/PS2_Port_Dual.avalon_ps2_slave baseAddress 0x10000108
add_connection CPU.data_master Pushbuttons.avalon_parallel_port_slave avalon
set_connection_parameter_value CPU.data_master/Pushbuttons.avalon_parallel_port_slave baseAddress 0x10000050
add_connection CPU.data_master Red_LEDs.avalon_parallel_port_slave avalon
set_connection_parameter_value CPU.data_master/Red_LEDs.avalon_parallel_port_slave baseAddress 0x10000000
add_connection CPU.data_master SD_Card.avalon_sdcard_slave avalon
set_connection_parameter_value CPU.data_master/SD_Card.avalon_sdcard_slave baseAddress 0x0b000000
add_connection CPU.data_master SDRAM.s1 avalon
set_connection_parameter_value CPU.data_master/SDRAM.s1 baseAddress 0x0000
add_connection CPU.data_master Serial_Port.avalon_rs232_slave avalon
set_connection_parameter_value CPU.data_master/Serial_Port.avalon_rs232_slave baseAddress 0x10001010
add_connection CPU.data_master sgdma_rx.csr avalon
set_connection_parameter_value CPU.data_master/sgdma_rx.csr baseAddress 0x08202440
add_connection CPU.data_master sgdma_tx.csr avalon
set_connection_parameter_value CPU.data_master/sgdma_tx.csr baseAddress 0x08202400
add_connection CPU.data_master Slider_Switches.avalon_parallel_port_slave avalon
set_connection_parameter_value CPU.data_master/Slider_Switches.avalon_parallel_port_slave baseAddress 0x10000040
add_connection CPU.data_master SRAM.avalon_sram_slave avalon
set_connection_parameter_value CPU.data_master/SRAM.avalon_sram_slave baseAddress 0x08000000
add_connection CPU.data_master sysid.control_slave avalon
set_connection_parameter_value CPU.data_master/sysid.control_slave baseAddress 0x10002020
add_connection CPU.data_master USB.avalon_usb_slave avalon
set_connection_parameter_value CPU.data_master/USB.avalon_usb_slave baseAddress 0x10000110
add_connection CPU.data_master VGA_Char_Buffer.avalon_char_buffer_slave avalon
set_connection_parameter_value CPU.data_master/VGA_Char_Buffer.avalon_char_buffer_slave baseAddress 0x09000000
add_connection CPU.data_master VGA_Char_Buffer.avalon_char_control_slave avalon
set_connection_parameter_value CPU.data_master/VGA_Char_Buffer.avalon_char_control_slave baseAddress 0x10003030
add_connection CPU.data_master VGA_DMA_Controller.avalon_dma_control_slave avalon
set_connection_parameter_value CPU.data_master/VGA_DMA_Controller.avalon_dma_control_slave baseAddress 0x10003020
add_connection CPU.data_master Video_In_DMA_Controller.avalon_dma_control_slave avalon
set_connection_parameter_value CPU.data_master/Video_In_DMA_Controller.avalon_dma_control_slave baseAddress 0x10003060
add_connection CPU.instruction_master CPU.jtag_debug_module avalon
set_connection_parameter_value CPU.instruction_master/CPU.jtag_debug_module baseAddress 0x0a000000
add_connection CPU.instruction_master Flash.flash_data avalon
set_connection_parameter_value CPU.instruction_master/Flash.flash_data baseAddress 0x0c000000
add_connection CPU.instruction_master SDRAM.s1 avalon
set_connection_parameter_value CPU.instruction_master/SDRAM.s1 baseAddress 0x0000
add_connection LCD_DMA_Controller.avalon_dma_master SRAM.avalon_sram_slave avalon
set_connection_parameter_value LCD_DMA_Controller.avalon_dma_master/SRAM.avalon_sram_slave baseAddress 0x08000000
add_connection sgdma_rx.descriptor_read descriptor_memory.s1 avalon
set_connection_parameter_value sgdma_rx.descriptor_read/descriptor_memory.s1 baseAddress 0x08200000
add_connection sgdma_rx.descriptor_write descriptor_memory.s1 avalon
set_connection_parameter_value sgdma_rx.descriptor_write/descriptor_memory.s1 baseAddress 0x08200000
add_connection sgdma_rx.m_write packet_memory.s1 avalon
set_connection_parameter_value sgdma_rx.m_write/packet_memory.s1 baseAddress 0x08201000
add_connection sgdma_tx.descriptor_read descriptor_memory.s1 avalon
set_connection_parameter_value sgdma_tx.descriptor_read/descriptor_memory.s1 baseAddress 0x08200000
add_connection sgdma_tx.descriptor_write descriptor_memory.s1 avalon
set_connection_parameter_value sgdma_tx.descriptor_write/descriptor_memory.s1 baseAddress 0x08200000
add_connection sgdma_tx.m_read packet_memory.s1 avalon
set_connection_parameter_value sgdma_tx.m_read/packet_memory.s1 baseAddress 0x08201000
add_connection VGA_DMA_Controller.avalon_dma_master SRAM.avalon_sram_slave avalon
set_connection_parameter_value VGA_DMA_Controller.avalon_dma_master/SRAM.avalon_sram_slave baseAddress 0x08000000
add_connection Video_In_DMA_Controller.avalon_dma_master SRAM.avalon_sram_slave avalon
set_connection_parameter_value Video_In_DMA_Controller.avalon_dma_master/SRAM.avalon_sram_slave baseAddress 0x08000000
add_connection Camera_Bayer_Resampler.avalon_bayer_source Camera_Scaler.avalon_scaler_sink avalon_streaming
add_connection Camera_Clipper.avalon_clipper_source Camera_RGB_Resampler.avalon_rgb_sink avalon_streaming
add_connection Camera_In.avalon_decoder_source Camera_Bayer_Resampler.avalon_bayer_sink avalon_streaming
add_connection Camera_RGB_Resampler.avalon_rgb_source Camera_DMA_Controller.avalon_dma_sink avalon_streaming
add_connection Camera_Scaler.avalon_scaler_source Camera_Clipper.avalon_clipper_sink avalon_streaming
add_connection enet.receive sgdma_rx.in avalon_streaming
add_connection LCD_Alpha_Blender.avalon_blended_source LCD_Dual_Clock_FIFO.avalon_dc_buffer_sink avalon_streaming
add_connection LCD_Char_Buffer.avalon_char_source LCD_Alpha_Blender.avalon_foreground_sink avalon_streaming
add_connection LCD_DMA_Controller.avalon_pixel_source LCD_RGB_Resampler.avalon_rgb_sink avalon_streaming
add_connection LCD_Dual_Clock_FIFO.avalon_dc_buffer_source LCD_Controller.avalon_vga_sink avalon_streaming
add_connection LCD_RGB_Resampler.avalon_rgb_source LCD_Scalar.avalon_scaler_sink avalon_streaming
add_connection LCD_Scalar.avalon_scaler_source LCD_Alpha_Blender.avalon_background_sink avalon_streaming
add_connection sgdma_tx.out enet.transmit avalon_streaming
add_connection VGA_Alpha_Blender.avalon_blended_source VGA_Dual_Clock_FIFO.avalon_dc_buffer_sink avalon_streaming
add_connection VGA_Char_Buffer.avalon_char_source VGA_Alpha_Blender.avalon_foreground_sink avalon_streaming
add_connection VGA_DMA_Controller.avalon_pixel_source VGA_Pixel_RGB_Resampler.avalon_rgb_sink avalon_streaming
add_connection VGA_Dual_Clock_FIFO.avalon_dc_buffer_source VGA_Controller.avalon_vga_sink avalon_streaming
add_connection VGA_Pixel_RGB_Resampler.avalon_rgb_source VGA_Pixel_Scaler.avalon_scaler_sink avalon_streaming
add_connection VGA_Pixel_Scaler.avalon_scaler_source VGA_Alpha_Blender.avalon_background_sink avalon_streaming
add_connection Video_In.avalon_decoder_source Video_In_Chroma_Resampler.avalon_chroma_sink avalon_streaming
add_connection Video_In_Chroma_Resampler.avalon_chroma_source Video_In_CSC.avalon_csc_sink avalon_streaming
add_connection Video_In_Clipper.avalon_clipper_source Video_In_Scaler.avalon_scaler_sink avalon_streaming
add_connection Video_In_CSC.avalon_csc_source Video_In_RGB_Resampler.avalon_rgb_sink avalon_streaming
add_connection Video_In_RGB_Resampler.avalon_rgb_source Video_In_Clipper.avalon_clipper_sink avalon_streaming
add_connection Video_In_Scaler.avalon_scaler_source Video_In_DMA_Controller.avalon_dma_sink avalon_streaming
add_connection CPU.d_irq Accelerometer.interrupt interrupt
set_connection_parameter_value CPU.d_irq/Accelerometer.interrupt irqNumber 15
add_connection CPU.d_irq Audio.interrupt interrupt
set_connection_parameter_value CPU.d_irq/Audio.interrupt irqNumber 6
add_connection CPU.d_irq belfft_0.interrupt_sender interrupt
set_connection_parameter_value CPU.d_irq/belfft_0.interrupt_sender irqNumber 12
add_connection CPU.d_irq Expansion_JP5.interrupt interrupt
set_connection_parameter_value CPU.d_irq/Expansion_JP5.interrupt irqNumber 11
add_connection CPU.d_irq Interval_Timer.irq interrupt
set_connection_parameter_value CPU.d_irq/Interval_Timer.irq irqNumber 0
add_connection CPU.d_irq IrDA.interrupt interrupt
set_connection_parameter_value CPU.d_irq/IrDA.interrupt irqNumber 9
add_connection CPU.d_irq JTAG_UART.irq interrupt
set_connection_parameter_value CPU.d_irq/JTAG_UART.irq irqNumber 8
add_connection CPU.d_irq PS2_Port.interrupt interrupt
set_connection_parameter_value CPU.d_irq/PS2_Port.interrupt irqNumber 7
add_connection CPU.d_irq PS2_Port_Dual.interrupt interrupt
set_connection_parameter_value CPU.d_irq/PS2_Port_Dual.interrupt irqNumber 17
add_connection CPU.d_irq Pushbuttons.interrupt interrupt
set_connection_parameter_value CPU.d_irq/Pushbuttons.interrupt irqNumber 1
add_connection CPU.d_irq Serial_Port.interrupt interrupt
set_connection_parameter_value CPU.d_irq/Serial_Port.interrupt irqNumber 10
add_connection CPU.d_irq sgdma_rx.csr_irq interrupt
set_connection_parameter_value CPU.d_irq/sgdma_rx.csr_irq irqNumber 3
add_connection CPU.d_irq sgdma_tx.csr_irq interrupt
set_connection_parameter_value CPU.d_irq/sgdma_tx.csr_irq irqNumber 4
add_connection CPU.d_irq Slider_Switches.interrupt interrupt
set_connection_parameter_value CPU.d_irq/Slider_Switches.interrupt irqNumber 5
add_connection CPU.d_irq USB.interrupt interrupt
set_connection_parameter_value CPU.d_irq/USB.interrupt irqNumber 2
add_connection CPU.custom_instruction_master CPU_fpoint.s1 nios_custom_instruction
set_connection_parameter_value CPU.custom_instruction_master/CPU_fpoint.s1 CIName fpoint
set_connection_parameter_value CPU.custom_instruction_master/CPU_fpoint.s1 baseAddress 252
